# EAGLE schematic schem_SMS-dumper (EAGLE 7.3.0)
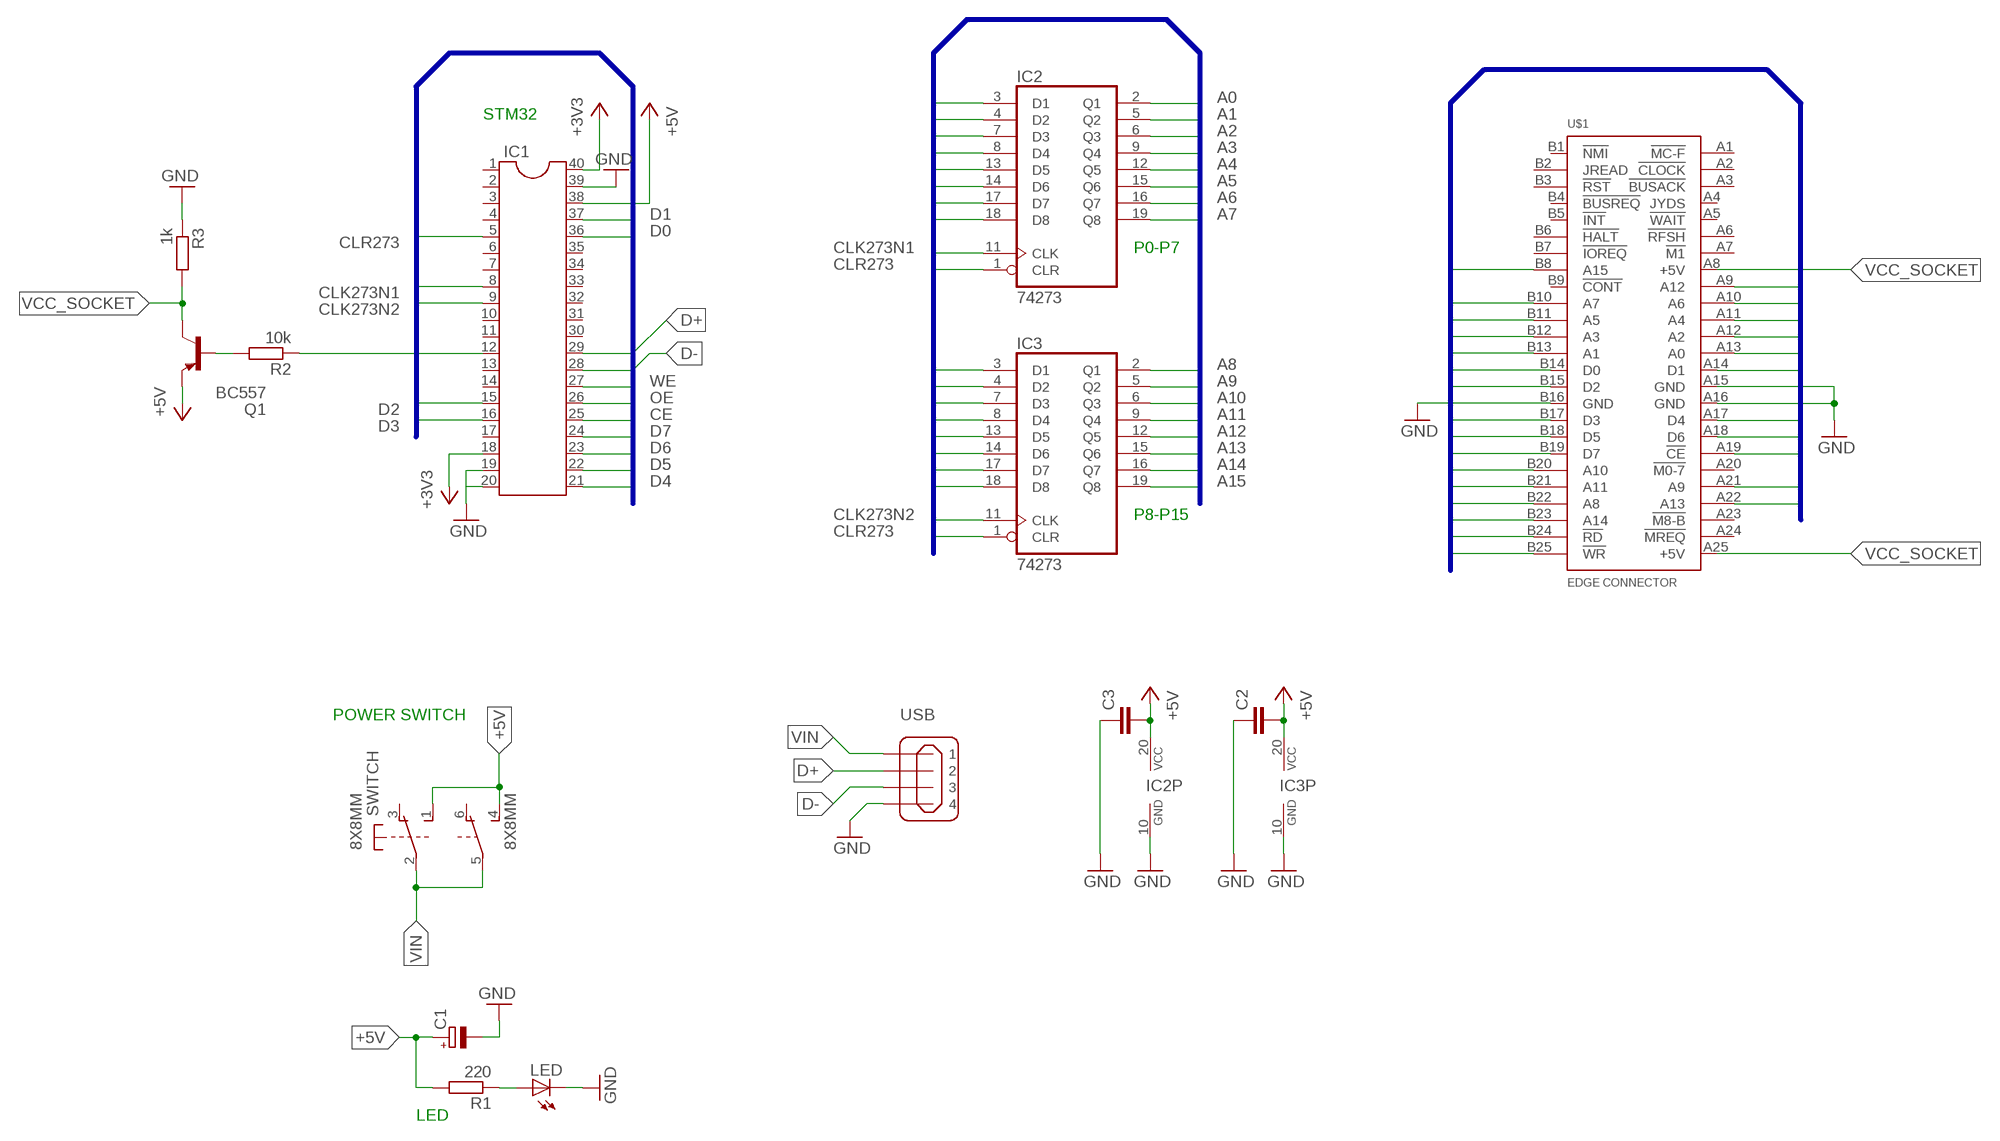
[diagram p0: schematic, sheet 1]

## Parts
8X8MM  SWITCH  PVA2  [PVA2F]
C1  CPOL-EUE2,5-6E  [E2,5-6E]
C2  C-EU050-024X044  [C050-024X044]
C3  C-EU050-024X044  [C050-024X044]
IC1  DIL40  [DIL40]
IC2  74273  74HC273N  [DIL20]
IC3  74273  74HC273N  [DIL20]
LED  LED5MM  [LED5MM]
Q1  BC557  [TO92-EBC]
R1  220  R-EU_0204/7  [0204/7]
R2  10k  R-EU_0204/7  [0204/7]
R3  1k  R-EU_0204/7  [0204/7]
U$1  EDGE CONNECTOR  ESMSF  [CARD50F]
USB  MINI-USB_4P-85-32004-10X  [85-32004-10X]

## Nets
+3V3: IC1.18 IC1.40
+5V: 8X8MM.1(1:S) 8X8MM.4(2:S) C1.+ C2.2 C3.2 IC1.38 IC2.20(VCC) IC3.20(VCC) Q1.E R1.2
A0: IC2.2(Q1) U$1.A13(A0)
A1: IC2.5(Q2) U$1.B13(A1)
A2: IC2.6(Q3) U$1.A12(A2)
A3: IC2.9(Q4) U$1.B12(A3)
A4: IC2.12(Q5) U$1.A11(A4)
A5: IC2.15(Q6) U$1.B11(A5)
A6: IC2.16(Q7) U$1.A10(A6)
A7: IC2.19(Q8) U$1.B10(A7)
A8: IC3.2(Q1) U$1.B22(A8)
A9: IC3.5(Q2) U$1.A21(A9)
A10: IC3.6(Q3) U$1.B20(A10)
A11: IC3.9(Q4) U$1.B21(A11)
A12: IC3.12(Q5) U$1.A9(A12)
A13: IC3.15(Q6) U$1.A22(A13)
A14: IC3.16(Q7) U$1.B23(A14)
A15: IC3.19(Q8) U$1.B8(A15)
CE: IC1.25 U$1.A19(!CE)
CLK273N1: IC1.8 IC2.11(CLK)
CLK273N2: IC1.9 IC3.11(CLK)
CLR273: IC1.5 IC2.1(CLR) IC3.1(CLR)
D0: IC1.36 IC2.3(D1) IC3.3(D1) U$1.B14(D0)
D1: IC1.37 IC2.4(D2) IC3.4(D2) U$1.A14(D1)
D2: IC1.15 IC2.7(D3) IC3.7(D3) U$1.B15(D2)
D3: IC1.16 IC2.8(D4) IC3.8(D4) U$1.B17(D3)
D4: IC1.21 IC2.13(D5) IC3.13(D5) U$1.A17(D4)
D5: IC1.22 IC2.14(D6) IC3.14(D6) U$1.B18(D5)
D6: IC1.23 IC2.17(D7) IC3.17(D7) U$1.A18(D6)
D7: IC1.24 IC2.18(D8) IC3.18(D8) U$1.B19(D7)
D+: IC1.29 USB.2
D-: IC1.28 USB.3
GND: C1.- C2.1 C3.1 IC1.19 IC1.20 IC1.39 IC2.10(GND) IC3.10(GND) LED.K(C) R3.1 U$1.A15(GND) U$1.A16(GND) U$1.B16(GND) USB.4
N$1: LED.A R1.1
N$2: IC1.12 R2.1
N$5: Q1.B R2.2
OE: IC1.26 U$1.B24(!RD)
VCC_SOCKET: Q1.C R3.2 U$1.A8(+5V) U$1.A25(+5V)
VIN: 8X8MM.2(1:P) 8X8MM.5(2:P) USB.1
WE: IC1.27 U$1.B25(!WR)
Unconnected: 8X8MM.3(1:O) 8X8MM.6(2:O) IC1.1 IC1.2 IC1.3 IC1.4 IC1.6 IC1.7 IC1.10 IC1.11 IC1.13 IC1.14 IC1.17 IC1.30 IC1.31 IC1.32 IC1.33 IC1.34 IC1.35 U$1.A1(!MC-F) U$1.A2(!CLOCK) U$1.A3(!BUSACK) U$1.A4(JYDS) U$1.A5(!WAIT) U$1.A6(!RFSH) U$1.A7(!M1) U$1.A20(!M0-7) U$1.A23(!M8-B) U$1.A24(!MREQ) U$1.B1(!NMI) U$1.B2(JREAD) U$1.B3(!RST) U$1.B4(!BUSREQ) U$1.B5(!INT) U$1.B6(!HALT) U$1.B7(!IOREQ) U$1.B9(!CONT)

## Buses
CLR273,CLK273N1,CLK273N2,CLK273N3,A[0..18],OE,CE,WE,D[0..7]

## Notes on the sheet
- STM32
- P0-P7
- P8-P15
- POWER SWITCH
- LED

## Library data of the parts
8X8MM = switch-misc:PVA2: ITT SWITCH
C1 = resistor:CPOL-EU: POLARIZED CAPACITOR, European symbol
C2 C3 = rcl:C-EU: CAPACITOR, European symbol
IC1 = ic-package:DIL40: Dual In Line
IC2 IC3 = 74xx-eu:74*273: Octal D type FLIP FLOP, clear
LED = led:LED: LED OSRAM: - CHIPLED LG R971, LG N971, LY N971, LG Q971, LY Q971, LO R971, LY R971 LH N974, LH R974 LS Q976, LO Q976, LY Q976 LO Q996 - Hyper CHIPLED LW Q18S LB Q993, LB Q99A, LB R99A - SideLED LS A670, LO A670, LY A670, LG A670, LP A670 LB A673, LV A673, LT A673, LW A673 LH A674 LY A675 LS A676, LA A676, LO A676, LY A676, LW A676 LS A679, LY A679, LG A679 - Hyper Micro SIDELED® LS Y876, LA Y876, LO Y876, LY Y876 LT Y87S - SmartLED LW L88C, LW L88S LB L89C, LB L89S, LG L890 LS L89K, LO L89K, LY L89K LS L896, LA L896, LO L896, LY L896 - TOPLED LS T670, LO T670, LY T670, LG T670, LP T670 LSG T670, LSP T670, LSY T670, LOP T670, LYG T670 LG T671, LOG T671, LSG T671 LB T673, LV T673, LT T673, LW T673 LH T674 LS T676, LA T676, LO T676, LY T676, LB T676, LH T676, LSB T676, LW T676 LB T67C, LV T67C, LT T67C, LS T67K, LO T67K, LY T67K, LW E67C LS E67B, LA E67B, LO E67B, LY E67B, LB E67C, LV E67C, LT E67C LW T67C LS T679, LY T679, LG T679 LS T770, LO T770, LY T770, LG T770, LP T770 LB T773, LV T773, LT T773, LW T773 LH T774 LS E675, LA E675, LY E675, LS T675 LS T776, LA T776, LO T776, LY T776, LB T776 LHGB T686 LT T68C, LB T68C - Hyper Mini TOPLED® LB M676 - Mini TOPLED Santana® LG M470 LS M47K, LO M47K, LY M47K Source: http://www.osram.convergy.de LUXEON: - LUMILED® LXK2-PW12-R00, LXK2-PW12-S00, LXK2-PW14-U00, LXK2-PW14-V00 LXK2-PM12-R00, LXK2-PM12-S00, LXK2-PM14-U00 LXK2-PE12-Q00, LXK2-PE12-R00, LXK2-PE12-S00, LXK2-PE14-T00, LXK2-PE14-U00 LXK2-PB12-K00, LXK2-PB12-L00, LXK2-PB12-M00, LXK2-PB14-N00, LXK2-PB14-P00, LXK2-PB14-Q00 LXK2-PR12-L00, LXK2-PR12-M00, LXK2-PR14-Q00, LXK2-PR14-R00 LXK2-PD12-Q00, LXK2-PD12-R00, LXK2-PD12-S00 LXK2-PH12-R00, LXK2-PH12-S00 LXK2-PL12-P00, LXK2-PL12-Q00, LXK2-PL12-R00 Source: www.luxeon.com KINGBRIGHT: KA-3528ASYC Source: www.kingbright.com
Q1 = transistor-pnp:BC557*: PNP Transistror
R1-R3 = resistor:R-EU_: RESISTOR, European symbol
U$1 = sega_parts:ESMS: Sega Master System, outside Japan/Korea, cartridge port The ordering of the address and data pins allows for simple connection to common ROM and EPROM chips. description taken from SMSPower.org µ 2011.01.19 D Lue Choy
USB = con-cypressindustries:MINI-USB_4P-: MINI USB 4 Pol. Source: www.cypressindustries.com; OC_FARNELL: unknown; OC_NEWARK: unknown